# Altium schematic sheet 01_ChangeLIST.SchDoc
size A3
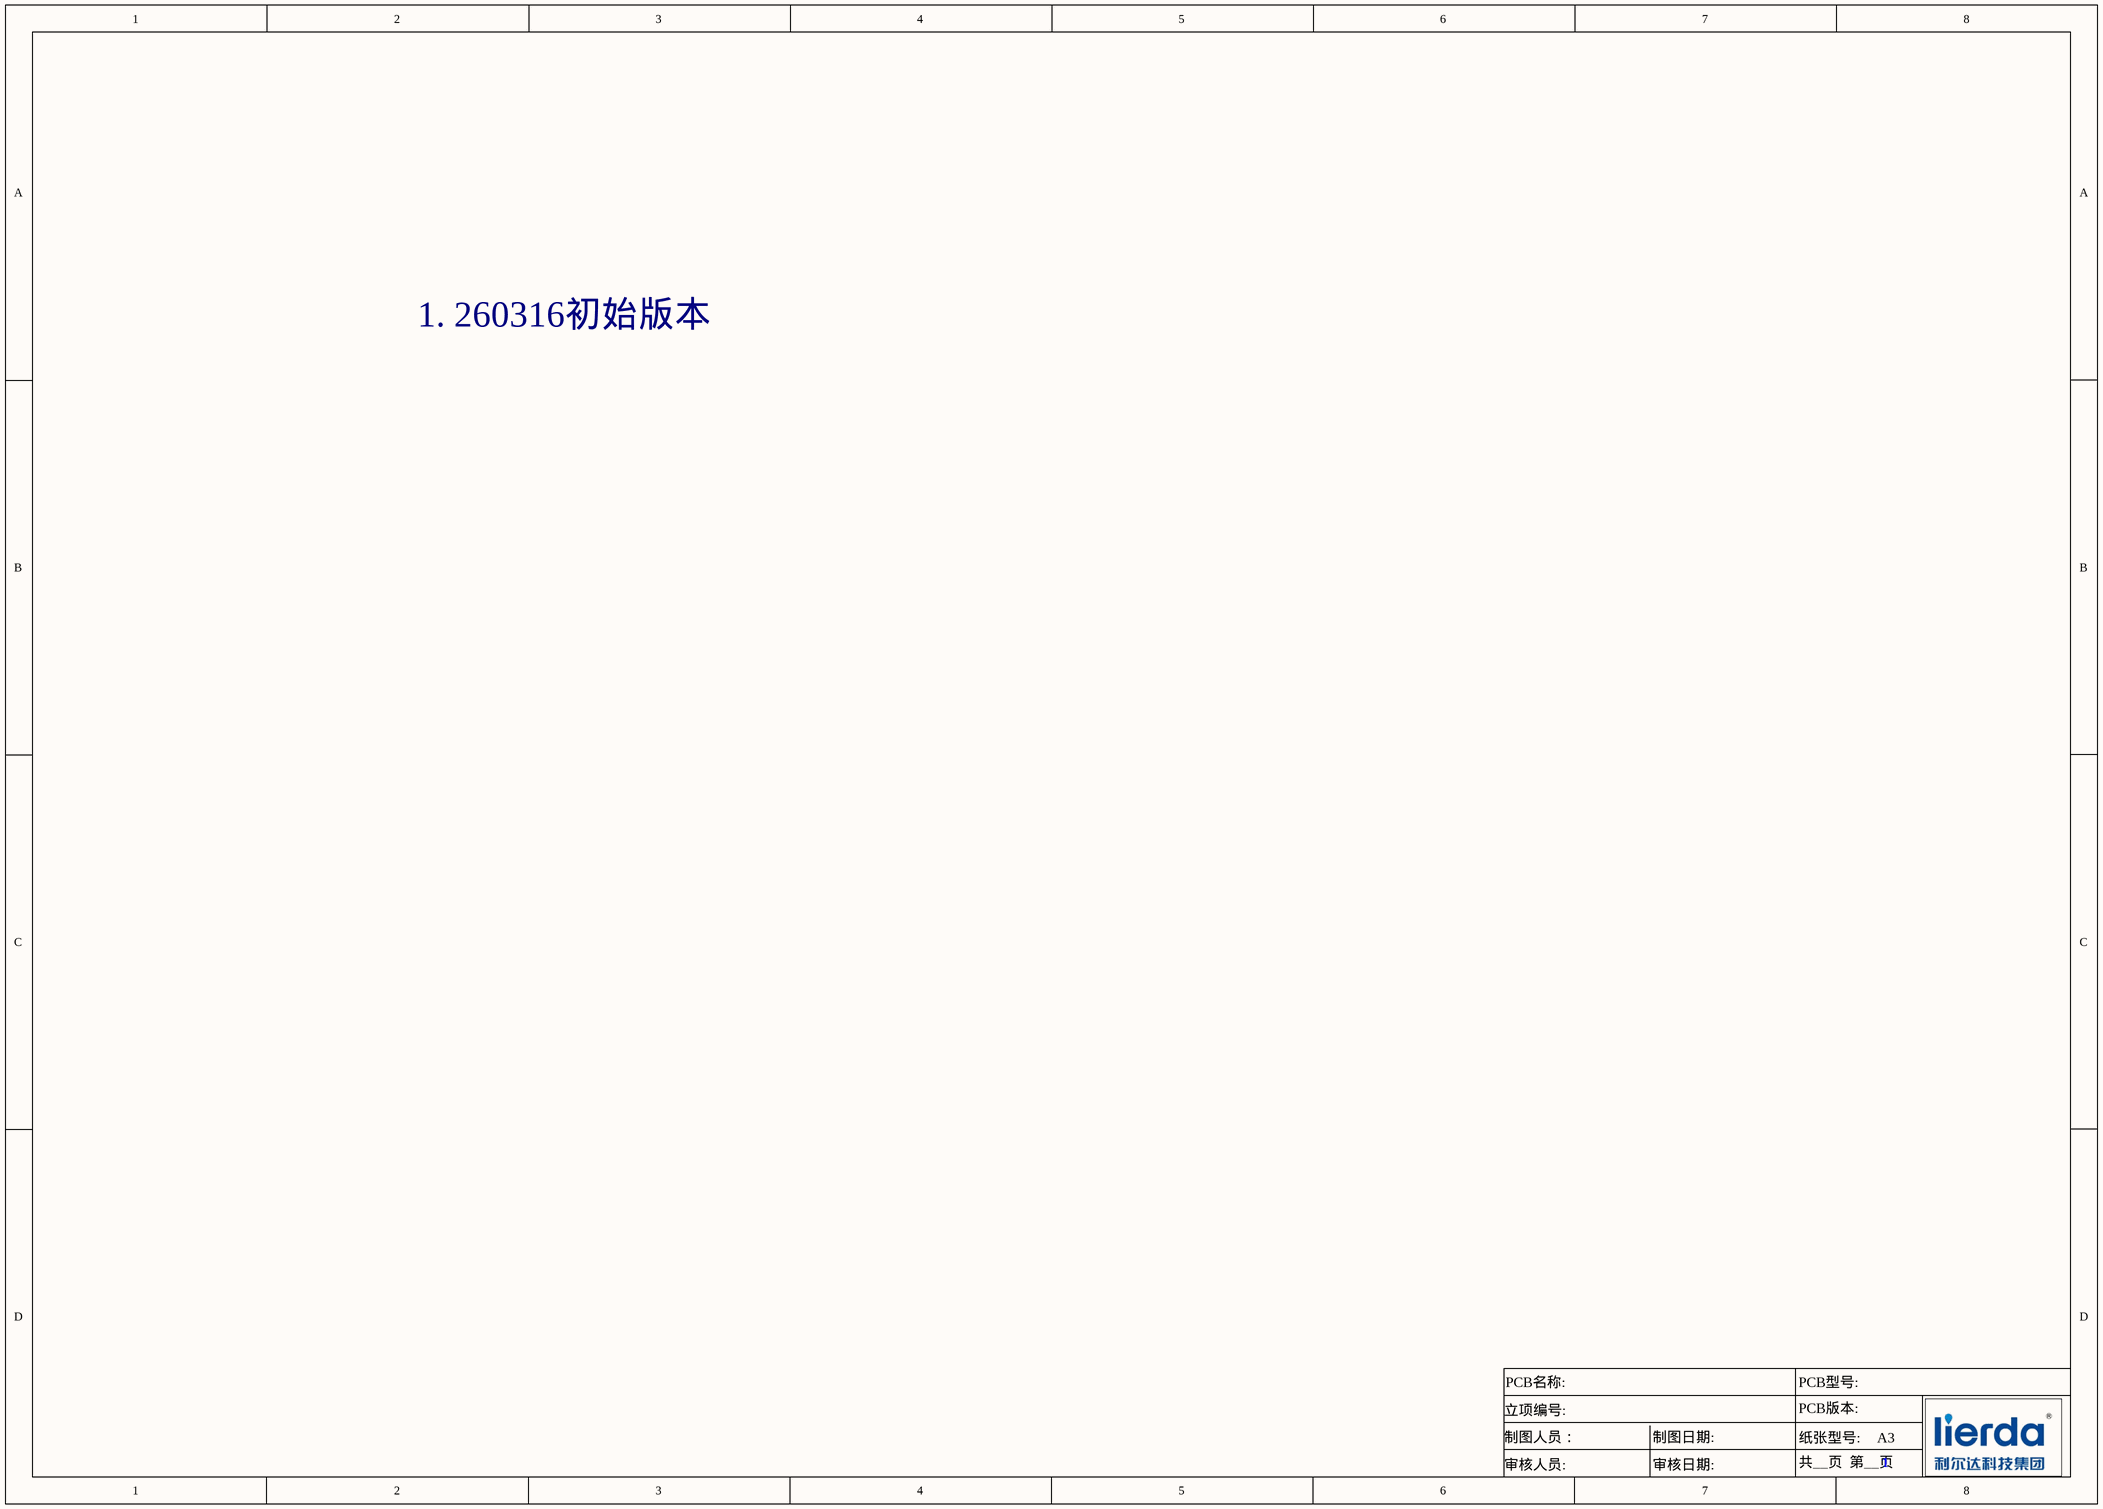
[diagram p0: 01_ChangeLIST.SchDoc]

## Notes on the sheet
- 1. 260316初始版本
- PCB名称:
- PCB型号:
- 制图人员：
- 立项编号:
- 制图日期:
- PCB版本:
- 纸张型号:
- A3
- 审核人员:
- 审核日期:
- 共__页  第__页
- 1